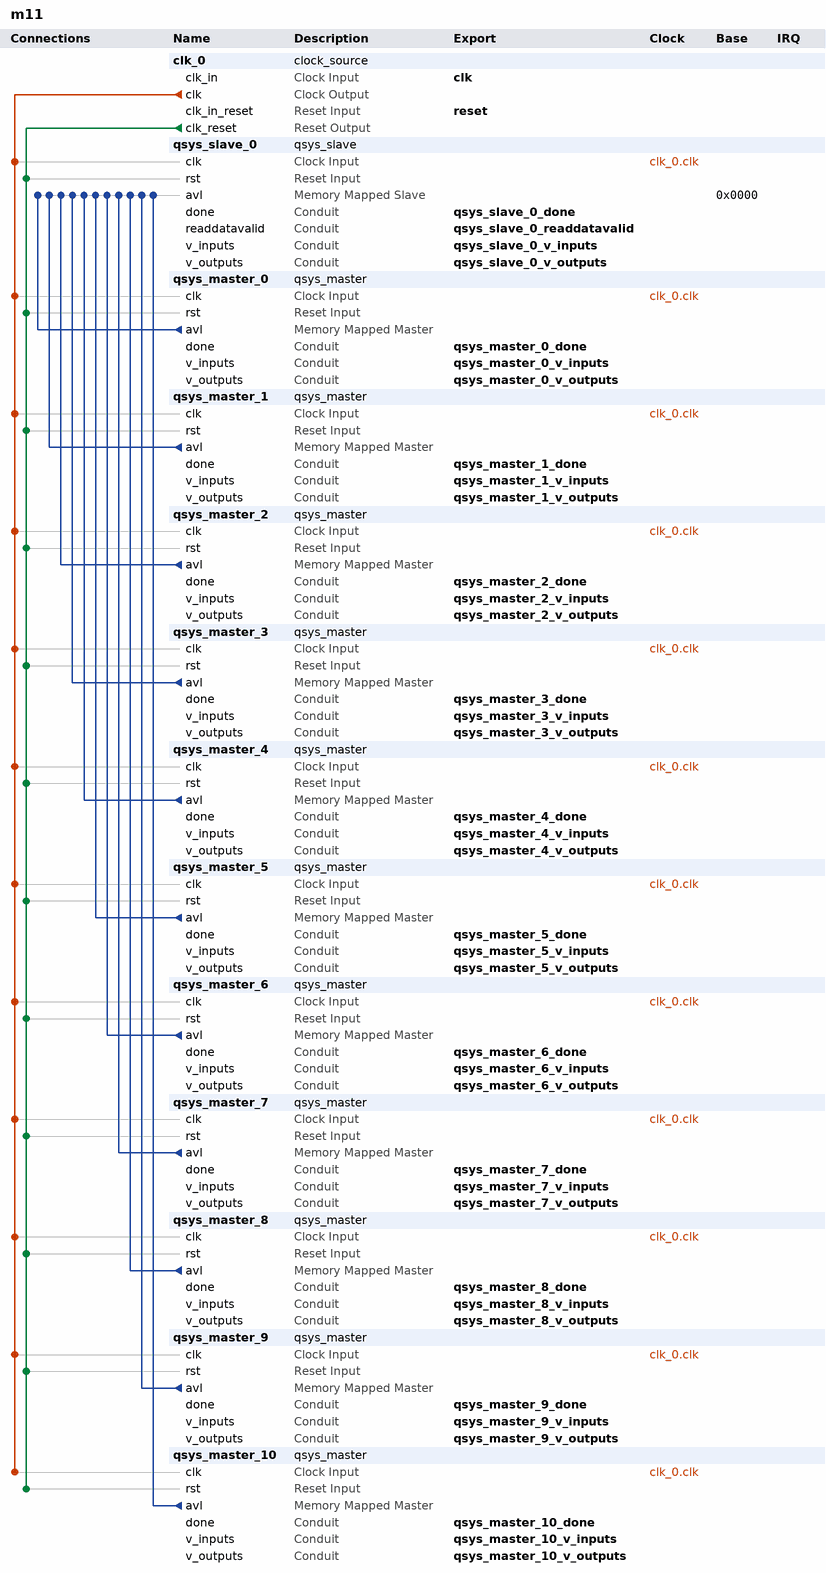
[diagram p0: system contents]
# Platform Designer (Qsys) system m11, Stratix V 5SGSED8K1F40C2
# Parameters at their usual value, and those the tool derives, are not listed.
package require -exact qsys 14.0
create_system m11
set_project_property DEVICE_FAMILY {Stratix V}
set_project_property DEVICE 5SGSED8K1F40C2

add_instance clk_0 clock_source 14.0
set_instance_parameter_value clk_0 clockFrequency 100000000

add_instance qsys_slave_0 qsys_slave 2.0
set_instance_parameter_value qsys_slave_0 WIDTH 32
set_instance_parameter_value qsys_slave_0 SRC_ID 0
set_instance_parameter_value qsys_slave_0 SNK_ID 1
set_instance_parameter_value qsys_slave_0 ADDR_WIDTH 30

add_instance qsys_master_0 qsys_master 2.0
set_instance_parameter_value qsys_master_0 WIDTH 32
set_instance_parameter_value qsys_master_0 SRC_ID 2
set_instance_parameter_value qsys_master_0 SNK_ID 3
set_instance_parameter_value qsys_master_0 DST_ID 0
set_instance_parameter_value qsys_master_0 ADDR_WIDTH 32

add_instance qsys_master_1 qsys_master 2.0
set_instance_parameter_value qsys_master_1 WIDTH 32
set_instance_parameter_value qsys_master_1 SRC_ID 2
set_instance_parameter_value qsys_master_1 SNK_ID 3
set_instance_parameter_value qsys_master_1 DST_ID 0
set_instance_parameter_value qsys_master_1 ADDR_WIDTH 32

add_instance qsys_master_2 qsys_master 2.0
set_instance_parameter_value qsys_master_2 WIDTH 32
set_instance_parameter_value qsys_master_2 SRC_ID 2
set_instance_parameter_value qsys_master_2 SNK_ID 3
set_instance_parameter_value qsys_master_2 DST_ID 0
set_instance_parameter_value qsys_master_2 ADDR_WIDTH 32

add_instance qsys_master_3 qsys_master 2.0
set_instance_parameter_value qsys_master_3 WIDTH 32
set_instance_parameter_value qsys_master_3 SRC_ID 2
set_instance_parameter_value qsys_master_3 SNK_ID 3
set_instance_parameter_value qsys_master_3 DST_ID 0
set_instance_parameter_value qsys_master_3 ADDR_WIDTH 32

add_instance qsys_master_4 qsys_master 2.0
set_instance_parameter_value qsys_master_4 WIDTH 32
set_instance_parameter_value qsys_master_4 SRC_ID 2
set_instance_parameter_value qsys_master_4 SNK_ID 3
set_instance_parameter_value qsys_master_4 DST_ID 0
set_instance_parameter_value qsys_master_4 ADDR_WIDTH 32

add_instance qsys_master_5 qsys_master 2.0
set_instance_parameter_value qsys_master_5 WIDTH 32
set_instance_parameter_value qsys_master_5 SRC_ID 2
set_instance_parameter_value qsys_master_5 SNK_ID 3
set_instance_parameter_value qsys_master_5 DST_ID 0
set_instance_parameter_value qsys_master_5 ADDR_WIDTH 32

add_instance qsys_master_6 qsys_master 2.0
set_instance_parameter_value qsys_master_6 WIDTH 32
set_instance_parameter_value qsys_master_6 SRC_ID 2
set_instance_parameter_value qsys_master_6 SNK_ID 3
set_instance_parameter_value qsys_master_6 DST_ID 0
set_instance_parameter_value qsys_master_6 ADDR_WIDTH 32

add_instance qsys_master_7 qsys_master 2.0
set_instance_parameter_value qsys_master_7 WIDTH 32
set_instance_parameter_value qsys_master_7 SRC_ID 2
set_instance_parameter_value qsys_master_7 SNK_ID 3
set_instance_parameter_value qsys_master_7 DST_ID 0
set_instance_parameter_value qsys_master_7 ADDR_WIDTH 32

add_instance qsys_master_8 qsys_master 2.0
set_instance_parameter_value qsys_master_8 WIDTH 32
set_instance_parameter_value qsys_master_8 SRC_ID 2
set_instance_parameter_value qsys_master_8 SNK_ID 3
set_instance_parameter_value qsys_master_8 DST_ID 0
set_instance_parameter_value qsys_master_8 ADDR_WIDTH 32

add_instance qsys_master_9 qsys_master 2.0
set_instance_parameter_value qsys_master_9 WIDTH 32
set_instance_parameter_value qsys_master_9 SRC_ID 2
set_instance_parameter_value qsys_master_9 SNK_ID 3
set_instance_parameter_value qsys_master_9 DST_ID 0
set_instance_parameter_value qsys_master_9 ADDR_WIDTH 32

add_instance qsys_master_10 qsys_master 2.0
set_instance_parameter_value qsys_master_10 WIDTH 32
set_instance_parameter_value qsys_master_10 SRC_ID 2
set_instance_parameter_value qsys_master_10 SNK_ID 3
set_instance_parameter_value qsys_master_10 DST_ID 0
set_instance_parameter_value qsys_master_10 ADDR_WIDTH 32

# connections
add_connection clk_0.clk qsys_master_0.clk clock
add_connection clk_0.clk qsys_master_1.clk clock
add_connection clk_0.clk qsys_master_2.clk clock
add_connection clk_0.clk qsys_master_3.clk clock
add_connection clk_0.clk qsys_master_4.clk clock
add_connection clk_0.clk qsys_master_5.clk clock
add_connection clk_0.clk qsys_master_6.clk clock
add_connection clk_0.clk qsys_master_7.clk clock
add_connection clk_0.clk qsys_master_8.clk clock
add_connection clk_0.clk qsys_master_9.clk clock
add_connection clk_0.clk qsys_master_10.clk clock
add_connection clk_0.clk qsys_slave_0.clk clock
add_connection clk_0.clk_reset qsys_master_0.rst reset
add_connection clk_0.clk_reset qsys_master_1.rst reset
add_connection clk_0.clk_reset qsys_master_2.rst reset
add_connection clk_0.clk_reset qsys_master_3.rst reset
add_connection clk_0.clk_reset qsys_master_4.rst reset
add_connection clk_0.clk_reset qsys_master_5.rst reset
add_connection clk_0.clk_reset qsys_master_6.rst reset
add_connection clk_0.clk_reset qsys_master_7.rst reset
add_connection clk_0.clk_reset qsys_master_8.rst reset
add_connection clk_0.clk_reset qsys_master_9.rst reset
add_connection clk_0.clk_reset qsys_master_10.rst reset
add_connection clk_0.clk_reset qsys_slave_0.rst reset
add_connection qsys_master_0.avl qsys_slave_0.avl avalon
set_connection_parameter_value qsys_master_0.avl/qsys_slave_0.avl baseAddress 0x0000
add_connection qsys_master_1.avl qsys_slave_0.avl avalon
set_connection_parameter_value qsys_master_1.avl/qsys_slave_0.avl baseAddress 0x0000
add_connection qsys_master_2.avl qsys_slave_0.avl avalon
set_connection_parameter_value qsys_master_2.avl/qsys_slave_0.avl baseAddress 0x0000
add_connection qsys_master_3.avl qsys_slave_0.avl avalon
set_connection_parameter_value qsys_master_3.avl/qsys_slave_0.avl baseAddress 0x0000
add_connection qsys_master_4.avl qsys_slave_0.avl avalon
set_connection_parameter_value qsys_master_4.avl/qsys_slave_0.avl baseAddress 0x0000
add_connection qsys_master_5.avl qsys_slave_0.avl avalon
set_connection_parameter_value qsys_master_5.avl/qsys_slave_0.avl baseAddress 0x0000
add_connection qsys_master_6.avl qsys_slave_0.avl avalon
set_connection_parameter_value qsys_master_6.avl/qsys_slave_0.avl baseAddress 0x0000
add_connection qsys_master_7.avl qsys_slave_0.avl avalon
set_connection_parameter_value qsys_master_7.avl/qsys_slave_0.avl baseAddress 0x0000
add_connection qsys_master_8.avl qsys_slave_0.avl avalon
set_connection_parameter_value qsys_master_8.avl/qsys_slave_0.avl baseAddress 0x0000
add_connection qsys_master_9.avl qsys_slave_0.avl avalon
set_connection_parameter_value qsys_master_9.avl/qsys_slave_0.avl baseAddress 0x0000
add_connection qsys_master_10.avl qsys_slave_0.avl avalon
set_connection_parameter_value qsys_master_10.avl/qsys_slave_0.avl baseAddress 0x0000

# exported interfaces
add_interface clk clock sink
set_interface_property clk EXPORT_OF clk_0.clk_in
add_interface reset reset sink
set_interface_property reset EXPORT_OF clk_0.clk_in_reset
add_interface qsys_master_1_done conduit end
set_interface_property qsys_master_1_done EXPORT_OF qsys_master_1.done
add_interface qsys_master_1_v_inputs conduit end
set_interface_property qsys_master_1_v_inputs EXPORT_OF qsys_master_1.v_inputs
add_interface qsys_master_1_v_outputs conduit end
set_interface_property qsys_master_1_v_outputs EXPORT_OF qsys_master_1.v_outputs
add_interface qsys_master_0_v_inputs conduit end
set_interface_property qsys_master_0_v_inputs EXPORT_OF qsys_master_0.v_inputs
add_interface qsys_master_0_v_outputs conduit end
set_interface_property qsys_master_0_v_outputs EXPORT_OF qsys_master_0.v_outputs
add_interface qsys_master_0_done conduit end
set_interface_property qsys_master_0_done EXPORT_OF qsys_master_0.done
add_interface qsys_slave_0_done conduit end
set_interface_property qsys_slave_0_done EXPORT_OF qsys_slave_0.done
add_interface qsys_slave_0_v_inputs conduit end
set_interface_property qsys_slave_0_v_inputs EXPORT_OF qsys_slave_0.v_inputs
add_interface qsys_slave_0_v_outputs conduit end
set_interface_property qsys_slave_0_v_outputs EXPORT_OF qsys_slave_0.v_outputs
add_interface qsys_slave_0_readdatavalid conduit end
set_interface_property qsys_slave_0_readdatavalid EXPORT_OF qsys_slave_0.readdatavalid
add_interface qsys_master_2_done conduit end
set_interface_property qsys_master_2_done EXPORT_OF qsys_master_2.done
add_interface qsys_master_2_v_inputs conduit end
set_interface_property qsys_master_2_v_inputs EXPORT_OF qsys_master_2.v_inputs
add_interface qsys_master_2_v_outputs conduit end
set_interface_property qsys_master_2_v_outputs EXPORT_OF qsys_master_2.v_outputs
add_interface qsys_master_3_done conduit end
set_interface_property qsys_master_3_done EXPORT_OF qsys_master_3.done
add_interface qsys_master_3_v_inputs conduit end
set_interface_property qsys_master_3_v_inputs EXPORT_OF qsys_master_3.v_inputs
add_interface qsys_master_3_v_outputs conduit end
set_interface_property qsys_master_3_v_outputs EXPORT_OF qsys_master_3.v_outputs
add_interface qsys_master_4_done conduit end
set_interface_property qsys_master_4_done EXPORT_OF qsys_master_4.done
add_interface qsys_master_4_v_inputs conduit end
set_interface_property qsys_master_4_v_inputs EXPORT_OF qsys_master_4.v_inputs
add_interface qsys_master_4_v_outputs conduit end
set_interface_property qsys_master_4_v_outputs EXPORT_OF qsys_master_4.v_outputs
add_interface qsys_master_5_done conduit end
set_interface_property qsys_master_5_done EXPORT_OF qsys_master_5.done
add_interface qsys_master_5_v_inputs conduit end
set_interface_property qsys_master_5_v_inputs EXPORT_OF qsys_master_5.v_inputs
add_interface qsys_master_5_v_outputs conduit end
set_interface_property qsys_master_5_v_outputs EXPORT_OF qsys_master_5.v_outputs
add_interface qsys_master_6_done conduit end
set_interface_property qsys_master_6_done EXPORT_OF qsys_master_6.done
add_interface qsys_master_6_v_inputs conduit end
set_interface_property qsys_master_6_v_inputs EXPORT_OF qsys_master_6.v_inputs
add_interface qsys_master_6_v_outputs conduit end
set_interface_property qsys_master_6_v_outputs EXPORT_OF qsys_master_6.v_outputs
add_interface qsys_master_7_done conduit end
set_interface_property qsys_master_7_done EXPORT_OF qsys_master_7.done
add_interface qsys_master_7_v_inputs conduit end
set_interface_property qsys_master_7_v_inputs EXPORT_OF qsys_master_7.v_inputs
add_interface qsys_master_7_v_outputs conduit end
set_interface_property qsys_master_7_v_outputs EXPORT_OF qsys_master_7.v_outputs
add_interface qsys_master_8_done conduit end
set_interface_property qsys_master_8_done EXPORT_OF qsys_master_8.done
add_interface qsys_master_8_v_inputs conduit end
set_interface_property qsys_master_8_v_inputs EXPORT_OF qsys_master_8.v_inputs
add_interface qsys_master_8_v_outputs conduit end
set_interface_property qsys_master_8_v_outputs EXPORT_OF qsys_master_8.v_outputs
add_interface qsys_master_9_done conduit end
set_interface_property qsys_master_9_done EXPORT_OF qsys_master_9.done
add_interface qsys_master_9_v_inputs conduit end
set_interface_property qsys_master_9_v_inputs EXPORT_OF qsys_master_9.v_inputs
add_interface qsys_master_9_v_outputs conduit end
set_interface_property qsys_master_9_v_outputs EXPORT_OF qsys_master_9.v_outputs
add_interface qsys_master_10_done conduit end
set_interface_property qsys_master_10_done EXPORT_OF qsys_master_10.done
add_interface qsys_master_10_v_inputs conduit end
set_interface_property qsys_master_10_v_inputs EXPORT_OF qsys_master_10.v_inputs
add_interface qsys_master_10_v_outputs conduit end
set_interface_property qsys_master_10_v_outputs EXPORT_OF qsys_master_10.v_outputs

set_interconnect_requirement {$system} qsys_mm.clockCrossingAdapter HANDSHAKE
set_interconnect_requirement {$system} qsys_mm.maxAdditionalLatency 4
set_interconnect_requirement {$system} qsys_mm.insertDefaultSlave FALSE

save_system m11.qsys
